# Altium schematic sheet NAVIGATION - SERVO.SchDoc
size A4; SheetNumber: 5; SheetTotal: 7
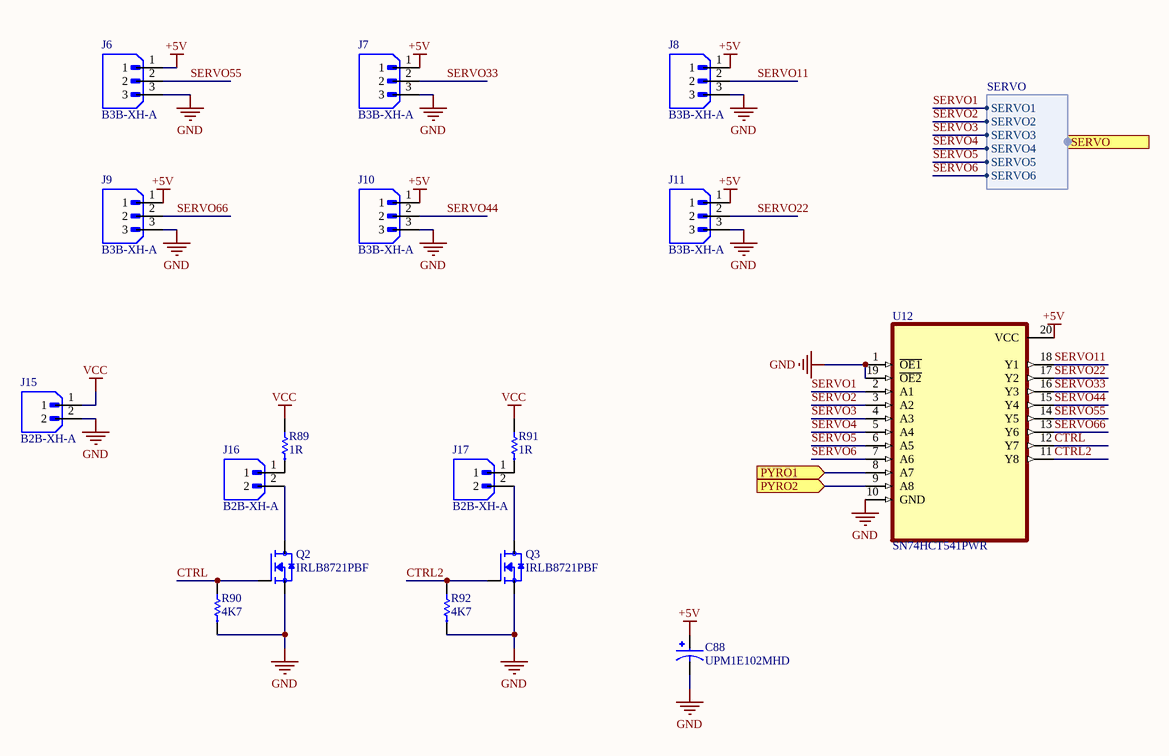
[diagram p0: NAVIGATION - SERVO.SchDoc]

## Parts
C88  UPM1E102MHD  [CAPPRD500W80D1250H2700]
J6  B3B-XH-A  [JST_B3B-XH-A]
J7  B3B-XH-A  [JST_B3B-XH-A]
J8  B3B-XH-A  [JST_B3B-XH-A]
J9  B3B-XH-A  [JST_B3B-XH-A]
J10  B3B-XH-A  [JST_B3B-XH-A]
J11  B3B-XH-A  [JST_B3B-XH-A]
J15  B2B-XH-A  [JST_B2B-XH-A]
J16  B2B-XH-A  [JST_B2B-XH-A]
J17  B2B-XH-A  [JST_B2B-XH-A]
Q2  IRLB8721PBF  [TO254P1067X483X2057-3]
Q3  IRLB8721PBF  [TO254P1067X483X2057-3]
R89  1R  [RES-CHP0402-0.35H]
R90  4K7  [RES-CHP0402-0.35H]
R91  1R  [RES-CHP0402-0.35H]
R92  4K7  [RES-CHP0402-0.35H]
U12  SN74HCT541PWR  [SOP65P640X120-20N]

## Ports
PYRO1 (in), PYRO2 (in), SERVO (harness SERVO)

## Harnesses
SERVO: SERVO1, SERVO2, SERVO3, SERVO4, SERVO5, SERVO6

## Nets
+5V: C88.P J6.1 J7.1 J8.1 J9.1 J10.1 J11.1 U12.20(VCC)
GND: C88.N J6.3 J7.3 J8.3 J9.3 J10.3 J11.3 J15.2 Q2.3(S) Q3.3(S) R90.1 R92.1 U12.1(~{OE1}) U12.10(GND) U12.19(~{OE2})
VCC: J15.1 R89.2 R91.2
CTRL: Q2.1(G) R90.2 U12.12(Y7)
CTRL2: Q3.1(G) R92.2 U12.11(Y8)
PYRO1: U12.8(A7) ; port PYRO1
PYRO2: U12.9(A8) ; port PYRO2
SERVO1: U12.2(A1) ; port SERVO.SERVO1
SERVO2: U12.3(A2) ; port SERVO.SERVO2
SERVO3: U12.4(A3) ; port SERVO.SERVO3
SERVO4: U12.5(A4) ; port SERVO.SERVO4
SERVO5: U12.6(A5) ; port SERVO.SERVO5
SERVO6: U12.7(A6) ; port SERVO.SERVO6
SERVO11: J8.2 U12.18(Y1)
SERVO22: J11.2 U12.17(Y2)
SERVO33: J7.2 U12.16(Y3)
SERVO44: J10.2 U12.15(Y4)
SERVO55: J6.2 U12.14(Y5)
SERVO66: J9.2 U12.13(Y6)
NetJ16_1: J16.1 R89.1
NetJ16_2: J16.2 Q2.2(D)
NetJ17_1: J17.1 R91.1
NetJ17_2: J17.2 Q3.2(D)

## Library data of the parts
C88 = UPM1E102MHD: Capacitor Aluminum Electrolytic Cap1000uF 25V 20% Radial 12.5X25 LS 5mm | Nichicon UPM1E102MHD; SnapEDA_Link: https://www.snapeda.com/parts/UPM1E102MHD/Nichicon/view-part/?ref=snap; Package: Radial Nichicon; Value: *; MF: Nichicon; MP: UPM1E102MHD; Check_prices: https://www.snapeda.com/parts/UPM1E102MHD/Nichicon/view-part/?ref=eda
J6-J11 = B3B-XH-A: Connector Header Through Hole 3 position 0.098 (2.50mm); MF: JST Sales; SnapEDA_Link: https://www.snapeda.com/parts/B3B-XH-A/JST+Sales+America+Inc./view-part/?ref=snap; Package: None; Value: *; MP: B3B-XH-A; Check_prices: https://www.snapeda.com/parts/B3B-XH-A/JST+Sales+America+Inc./view-part/?ref=eda
J15-J17 = B2B-XH-A: MF: {'manufacturer': u'JST Sales America Inc.'}; Package: None; Price: None; Value: *; MP: B2B-XH-A; Availability: Unavailable
Q2 Q3 = IRLB8721PBF: IRLB8721PBF N-channel MOSFET Transistor, 62 A, 30 V, 3-Pin TO-220AB | Infineon IRLB8721PBF; MF: Infineon Technologies; SnapEDA_Link: https://www.snapeda.com/parts/IRLB8721PBF/Infineon/view-part/?ref=snap; Package: TO-220-3 Infineon; Value: *; MP: IRLB8721PBF; Check_prices: https://www.snapeda.com/parts/IRLB8721PBF/Infineon/view-part/?ref=eda
R89-R92 = RESCHP0001 0R 1% 0402 SMD: RES CHP 0R 1% 1/16W 0402 SMD; MFR PN: NA; LINE: SMT; UNIT: PCS; TMG CODE: None; CLASS: B; MOUNT: SMD; TYPE: EP; TMG PN: RESCHP0001; CERTIFICATION: NA; ComponentLink1Description: Datasheet; ComponentLink1URL: https://datasheet.lcsc.com/lcsc/2207281800_Sunway-SC0402F0000I2ANRH_C3152056.pdf; Footprint: 0402
U12 = SN74HCT541PWR: Package: None; Price: None; Value: *; MP: SN74HCT541PWR; Availability: Unavailable